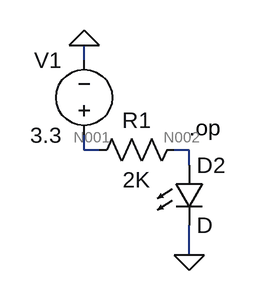
[diagram p0: schematic ESP32DevKitCv4_PowerLEDConsumption.asc]
ESP32DevKitCv4_PowerLEDConsumption.asc, the LTspice schematic file:
Version 4.1
SHEET 1 880 680
WIRE 64 -16 64 -32
WIRE 64 80 64 64
WIRE 80 80 64 80
WIRE 176 80 160 80
WIRE 176 96 176 80
WIRE 176 192 176 160
FLAG 176 192 0
FLAG 64 -32 0
SYMBOL voltage 64 80 R180
WINDOW 0 24 96 Left 2
WINDOW 3 24 16 Left 2
SYMATTR InstName V1
SYMATTR Value 3.3
SYMBOL res 176 64 R90
WINDOW 0 0 56 VBottom 2
WINDOW 3 32 56 VTop 2
SYMATTR InstName R1
SYMATTR Value 2K
SYMBOL LED 160 96 R0
SYMATTR InstName D2
TEXT 176 56 Left 2 !.op

The netlist it stands for:
* ESP32DevKitCv4_PowerLEDConsumption.asc
V1 N001 0 3.3
R1 N002 N001 2K
D2 N002 0 D
.model D D
.lib standard.dio
.op
.backanno
.end

* Results of the author's LTspice run, read from the files saved beside the schematic
* Operating Point:
*   V(n001) = 3.3 V
*   V(n002) = 662.3 mV
*   I(D2) = 1.319 mA
*   I(R1) = -1.319 mA
*   I(V1) = -1.319 mA